# Altium schematic sheet MCU.SchDoc
size A4
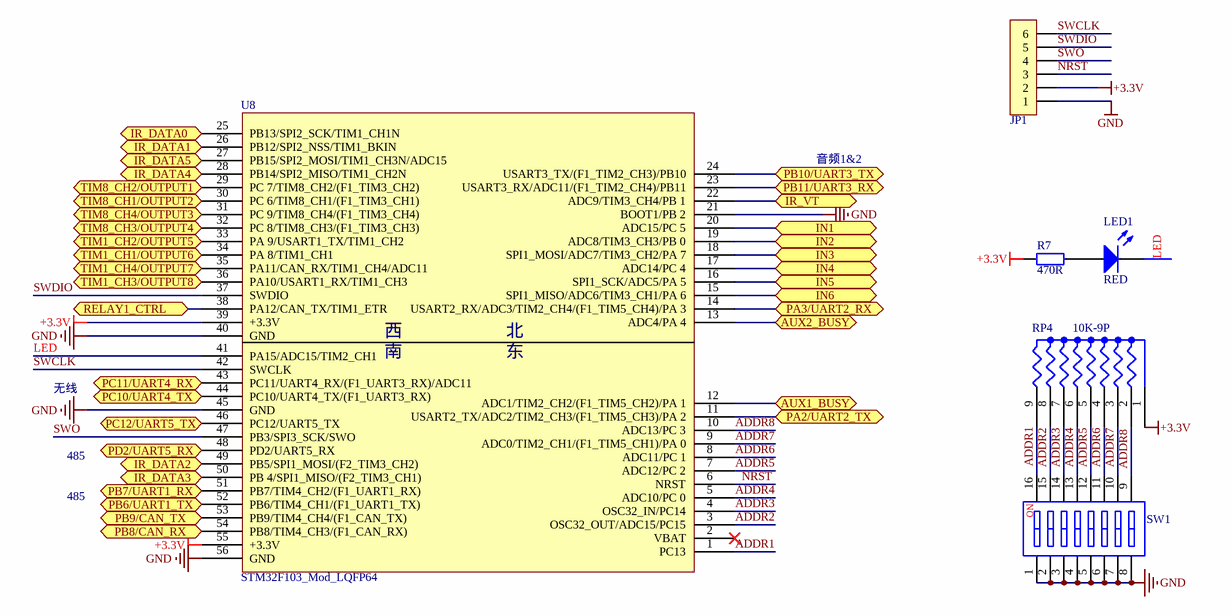
[diagram p0: MCU.SchDoc]

## Parts
JP1  HDR-1X6  [XH2.54-6P]  (value not drawn)
LED1  RED  [LED 5MM-R]
R7  470R  [R 0805]
RP4  10K-9P  [HDR1X9_1]
SW1  CSW-8P  [CSW DIP-8P_G]  (value not drawn)
U8  STM32F103_Mod_LQFP64  [STM32F103_LQFP64]

## Ports
AUX1_BUSY, AUX2_BUSY, IN1, IN2, IN3, IN4, IN5, IN6, IR_DATA0 (bidir), IR_DATA1 (bidir), IR_DATA2 (bidir), IR_DATA3 (bidir), IR_DATA4 (bidir), IR_DATA5 (bidir), IR_VT (bidir), PA2/UART2_TX, PA3/UART2_RX, PB6/UART1_TX, PB7/UART1_RX, PB8/CAN_RX, PB9/CAN_TX, PB10/UART3_TX, PB11/UART3_RX, PC10/UART4_TX, PC11/UART4_RX, PC12/UART5_TX, PD2/UART5_RX, RELAY1_CTRL (bidir), TIM1_CH1/OUTPUT6, TIM1_CH2/OUTPUT5, TIM1_CH3/OUTPUT8, TIM1_CH4/OUTPUT7, TIM8_CH1/OUTPUT2, TIM8_CH2/OUTPUT1, TIM8_CH3/OUTPUT4, TIM8_CH4/OUTPUT3

## Nets
+3.3V: JP1.2 R7.2 RP4.1 U8.39(+3.3V) U8.55(+3.3V)
GND: JP1.1 SW1.1 SW1.2 SW1.3 SW1.4 SW1.5 SW1.6 SW1.7 SW1.8 U8.21(BOOT1/PB_2) U8.40(GND) U8.45(GND) U8.56(GND)
ADDR1: RP4.9 SW1.16 U8.1(PC13)
ADDR2: RP4.8 SW1.15 U8.3(OSC32_OUT/ADC15/PC15)
ADDR3: RP4.7 SW1.14 U8.4(OSC32_IN/PC14)
ADDR4: RP4.6 SW1.13 U8.5(ADC10/PC_0)
ADDR5: RP4.5 SW1.12 U8.7(ADC12/PC_2)
ADDR6: RP4.4 SW1.11 U8.8(ADC11/PC_1)
ADDR7: RP4.3 SW1.10 U8.9(ADC0/TIM2_CH1/(F1_TIM5_CH1)/PA_0)
ADDR8: RP4.2 SW1.9 U8.10(ADC13/PC_3)
AUX1_BUSY: U8.12(ADC1/TIM2_CH2/(F1_TIM5_CH2)/PA_1) ; port AUX1_BUSY
AUX2_BUSY: U8.13(ADC4/PA_4) ; port AUX2_BUSY
IN1: U8.20(ADC15/PC_5) ; port IN1
IN2: U8.19(ADC8/TIM3_CH3/PB_0) ; port IN2
IN3: U8.18(SPI1_MOSI/ADC7/TIM3_CH2/PA_7) ; port IN3
IN4: U8.17(ADC14/PC_4) ; port IN4
IN5: U8.16(SPI1_SCK/ADC5/PA_5) ; port IN5
IN6: U8.15(SPI1_MISO/ADC6/TIM3_CH1/PA_6) ; port IN6
IR_DATA0: U8.25(PB13/SPI2_SCK/TIM1_CH1N) ; port IR_DATA0
IR_DATA1: U8.26(PB12/SPI2_NSS/TIM1_BKIN) ; port IR_DATA1
IR_DATA2: U8.49(PB5/SPI1_MOSI/(F2_TIM3_CH2)) ; port IR_DATA2
IR_DATA3: U8.50(PB_4/SPI1_MISO/(F2_TIM3_CH1)) ; port IR_DATA3
IR_DATA4: U8.28(PB14/SPI2_MISO/TIM1_CH2N) ; port IR_DATA4
IR_DATA5: U8.27(PB15/SPI2_MOSI/TIM1_CH3N/ADC15) ; port IR_DATA5
IR_VT: U8.22(ADC9/TIM3_CH4/PB_1) ; port IR_VT
LED: LED1.2(K) U8.41(PA15/ADC15/TIM2_CH1)
NRST: JP1.3 U8.6(NRST)
PA2/UART2_TX: U8.11(USART2_TX/ADC2/TIM2_CH3/(F1_TIM5_CH3)/PA_2) ; port PA2/UART2_TX
PA3/UART2_RX: U8.14(USART2_RX/ADC3/TIM2_CH4/(F1_TIM5_CH4)/PA_3) ; port PA3/UART2_RX
PB6/UART1_TX: U8.52(PB6/TIM4_CH1/(F1_UART1_TX)) ; port PB6/UART1_TX
PB7/UART1_RX: U8.51(PB7/TIM4_CH2/(F1_UART1_RX)) ; port PB7/UART1_RX
PB8/CAN_RX: U8.54(PB8/TIM4_CH3/(F1_CAN_RX)) ; port PB8/CAN_RX
PB9/CAN_TX: U8.53(PB9/TIM4_CH4/(F1_CAN_TX)) ; port PB9/CAN_TX
PB10/UART3_TX: U8.24(USART3_TX/(F1_TIM2_CH3)/PB10) ; port PB10/UART3_TX
PB11/UART3_RX: U8.23(USART3_RX/ADC11/(F1_TIM2_CH4)/PB11) ; port PB11/UART3_RX
PC10/UART4_TX: U8.44(PC10/UART4_TX/(F1_UART3_RX)) ; port PC10/UART4_TX
PC11/UART4_RX: U8.43(PC11/UART4_RX/(F1_UART3_RX)/ADC11) ; port PC11/UART4_RX
PC12/UART5_TX: U8.46(PC12/UART5_TX) ; port PC12/UART5_TX
PD2/UART5_RX: U8.48(PD2/UART5_RX) ; port PD2/UART5_RX
RELAY1_CTRL: U8.38(PA12/CAN_TX/TIM1_ETR) ; port RELAY1_CTRL
SWCLK: JP1.6 U8.42(SWCLK)
SWDIO: JP1.5 U8.37(SWDIO)
SWO: JP1.4 U8.47(PB3/SPI3_SCK/SWO)
TIM1_CH1/OUTPUT6: U8.34(PA_8/TIM1_CH1) ; port TIM1_CH1/OUTPUT6
TIM1_CH2/OUTPUT5: U8.33(PA_9/USART1_TX/TIM1_CH2) ; port TIM1_CH2/OUTPUT5
TIM1_CH3/OUTPUT8: U8.36(PA10/USART1_RX/TIM1_CH3) ; port TIM1_CH3/OUTPUT8
TIM1_CH4/OUTPUT7: U8.35(PA11/CAN_RX/TIM1_CH4/ADC11) ; port TIM1_CH4/OUTPUT7
TIM8_CH1/OUTPUT2: U8.30(PC_6/TIM8_CH1/(F1_TIM3_CH1)) ; port TIM8_CH1/OUTPUT2
TIM8_CH2/OUTPUT1: U8.29(PC_7/TIM8_CH2/(F1_TIM3_CH2)) ; port TIM8_CH2/OUTPUT1
TIM8_CH3/OUTPUT4: U8.32(PC_8/TIM8_CH3/(F1_TIM3_CH3)) ; port TIM8_CH3/OUTPUT4
TIM8_CH4/OUTPUT3: U8.31(PC_9/TIM8_CH4/(F1_TIM3_CH4)) ; port TIM8_CH4/OUTPUT3
NetLED1_1: LED1.1(A) R7.1

Not connected (* = marked no-connect by the designer): U8 2(VBAT)*

## Notes on the sheet
- 音频1&2
- 无线
- 485
- 设 计
- 制 图
- 审 核
- 类 别
- 签  字
- 日 期
- 产 品
- 名 称
- 零 件
- 板  名
- 数  量
- 共  张
- 第  张
- 批 准
- 文件编号
- 沈阳市创奇游乐设备有限公司
- (in symbol CSW-8P) NO
- (in symbol STM32F103_Mod_LQFP64) 西; 北; 南; 东

## Library data of the parts
JP1 = Header 6: 6P接插件; 版权归属: 源创客; BOM名称: 6P接插件; 学习资源: www.ooocke.com
LED1 = LED
R7 = Res1
RP4 = RESNW_8/SIP9
SW1 = CSW-8P: 8路编码开关; 版权归属: 源创客; BOM名称: 8路编码开关; 学习资源: www.ooocke.com
U8 = STM32F103_Mod_LQFP64: STM32F103RCT6